# Altium schematic sheet InfoDisplay.SchDoc
size A4
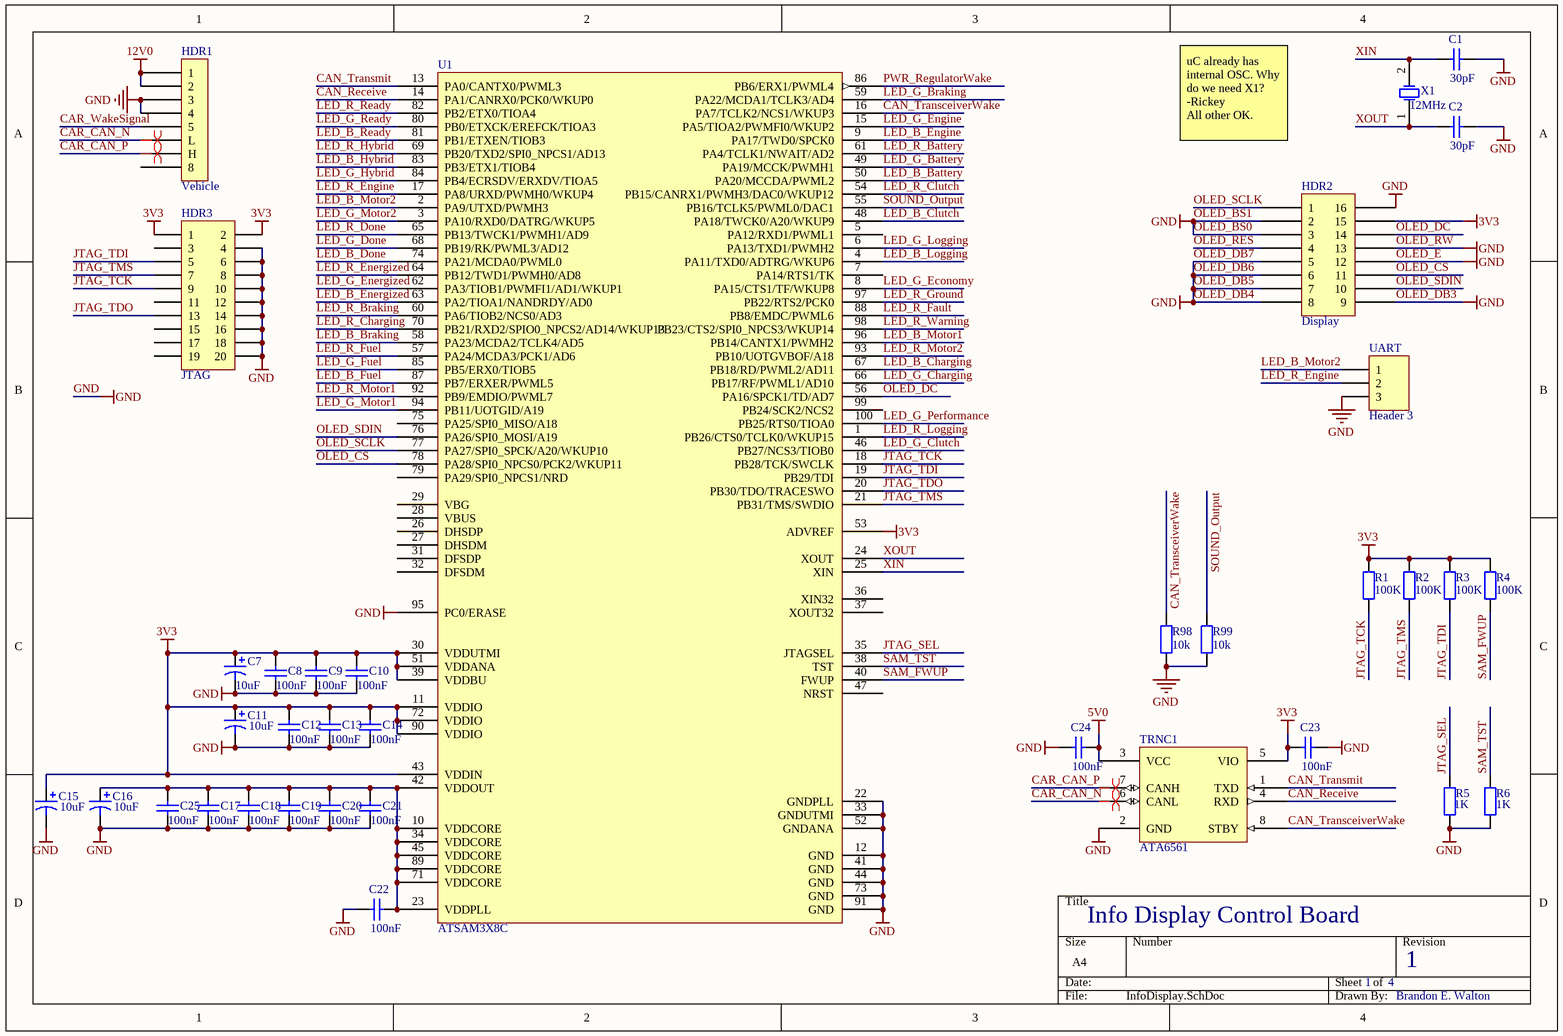
[diagram p0: InfoDisplay.SchDoc]

## Parts
C1  value 30pF  [1608[0603]]  (hidden comment: CL10C300FB8NNNC)
C2  value 30pF  [1608[0603]]  (hidden comment: Cap)
C7  value 10uF  [CAPC3216M]  (hidden comment: Cap Pol1)
C8  value 100nF  [CAPC1608M]  (hidden comment: Cap)
C9  value 100nF  [CAPC1608M]  (hidden comment: Cap)
C10  value 100nF  [CAPC1608M]  (hidden comment: Cap)
C11  value 10uF  [CAPC3216M]  (hidden comment: Cap Pol1)
C12  value 100nF  [CAPC1608M]  (hidden comment: Cap)
C13  value 100nF  [CAPC1608M]  (hidden comment: Cap)
C14  value 100nF  [CAPC1608M]  (hidden comment: Cap)
C15  value 10uF  [CAPC3216M]  (hidden comment: Cap Pol1)
C16  value 10uF  [CAPC3216M]  (hidden comment: Cap Pol1)
C17  value 100nF  [CAPC1608M]  (hidden comment: Cap)
C18  value 100nF  [CAPC1608M]  (hidden comment: Cap)
C19  value 100nF  [CAPC1608M]  (hidden comment: Cap)
C20  value 100nF  [CAPC1608M]  (hidden comment: Cap)
C21  value 100nF  [CAPC1608M]  (hidden comment: Cap)
C22  value 100nF  [CAPC1608M]  (hidden comment: Cap)
C23  value 100nF  [CAPC1608M]  (hidden comment: Cap)
C24  value 100nF  [CAPC1608M]  (hidden comment: Cap)
C25  value 100nF  [CAPC1608M]  (hidden comment: Cap)
HDR1  Vehicle  [Molex_DuraClick_8Pin_Vertical]
HDR2  Display  [Molex_iGrid_16Pin_Vertical_Alt]
HDR3  JTAG  [HDR2X10]
R1  value 100K  [1608[0603]]  (hidden comment: Res2)
R2  value 100K  [1608[0603]]  (hidden comment: Res2)
R3  value 100K  [1608[0603]]  (hidden comment: Res2)
R4  value 100K  [1608[0603]]  (hidden comment: Res2)
R5  value 1K  [1608[0603]]  (hidden comment: Res2)
R6  value 1K  [1608[0603]]  (hidden comment: Res2)
R98  value 10k  [1608[0603]]  (hidden comment: RC0603JR-0710KL)
R99  value 10k  [1608[0603]]  (hidden comment: 311-10KGRCT-ND)
TRNC1  ATA6561  [SOP127P600X165-8M]
U1  ATSAM3X8C  [100-LQFP]
UART  Header 3  [HDR1X3]
X1  12MHz  [XTAL]

## Nets
3V3: C7.1 C8.1 C9.1 C10.1 C11.1 C12.1 C13.1 C14.1 C15.1 C23.2 HDR2.15 HDR3.1 HDR3.2 R1.2 R2.2 R3.2 R4.2 TRNC1.5(VIO) U1.11(VDDIO) U1.30(VDDUTMI) U1.39(VDDBU) U1.43(VDDIN) U1.51(VDDANA) U1.53(ADVREF) U1.72(VDDIO) U1.90(VDDIO)
5V0: C24.1 TRNC1.3(VCC)
12V0: HDR1.A1(1) HDR1.A2(2)
GND: C1.1 C2.1 C7.2 C8.2 C9.2 C10.2 C11.2 C12.2 C13.2 C14.2 C15.2 C16.2 C17.2 C18.2 C19.2 C20.2 C21.2 C22.2 C23.1 C24.2 C25.2 HDR1.A3(3) HDR1.A4(4) HDR2.2 HDR2.3 HDR2.5 HDR2.6 HDR2.7 HDR2.8 HDR2.9 HDR2.12 HDR2.13 HDR2.16 HDR3.4 HDR3.6 HDR3.8 HDR3.10 HDR3.12 HDR3.14 HDR3.16 HDR3.18 HDR3.20 R5.1 R6.1 R98.1 R99.1 TRNC1.2(GND) U1.12(GND) U1.22(GNDPLL) U1.33(GNDUTMI) U1.41(GND) U1.44(GND) U1.52(GNDANA) U1.73(GND) U1.91(GND) U1.95(PC0/ERASE) UART.3  [also labelled OLED_BS0, OLED_BS1, OLED_DB3, OLED_DB4, OLED_DB5, OLED_DB6, OLED_DB7, OLED_E, OLED_RW]
CAN_Receive: TRNC1.4(RXD) U1.14(PA1/CANRX0/PCK0/WKUP0)
CAN_TransceiverWake: R98.2 TRNC1.8(STBY) U1.16(PA7/TCLK2/NCS1/WKUP3)
CAN_Transmit: TRNC1.1(TXD) U1.13(PA0/CANTX0/PWML3)
CAR_CAN_N: HDR1.A6(L) TRNC1.6(CANL)
CAR_CAN_P: HDR1.A7(H) TRNC1.7(CANH)
CAR_WakeSignal: HDR1.A5(5)
JTAG_SEL: R5.2 U1.35(JTAGSEL)
JTAG_TCK: HDR3.9 R1.1 U1.18(PB28/TCK/SWCLK)
JTAG_TDI: HDR3.5 R3.1 U1.19(PB29/TDI)
JTAG_TDO: HDR3.13 U1.20(PB30/TDO/TRACESWO)
JTAG_TMS: HDR3.7 R2.1 U1.21(PB31/TMS/SWDIO)
LED_B_Battery: U1.50(PA20/MCCDA/PWML2)
LED_B_Braking: U1.58(PA23/MCDA2/TCLK4/AD5)
LED_B_Charging: U1.67(PB18/RD/PWML2/AD11)
LED_B_Clutch: U1.48(PA18/TWCK0/A20/WKUP9)
LED_B_Done: U1.74(PA21/MCDA0/PWML0)
LED_B_Energized: U1.63(PA2/TIOA1/NANDRDY/AD0)
LED_B_Engine: U1.9(PA17/TWD0/SPCK0)
LED_B_Fuel: U1.87(PB7/ERXER/PWML5)
LED_B_Hybrid: U1.83(PB3/ETX1/TIOB4)
LED_B_Logging: U1.4(PA11/TXD0/ADTRG/WKUP6)
LED_B_Motor1: U1.96(PB14/CANTX1/PWMH2)
LED_B_Motor2: U1.2(PA9/UTXD/PWMH3) UART.1
LED_B_Ready: U1.81(PB1/ETXEN/TIOB3)
LED_G_Battery: U1.49(PA19/MCCK/PWMH1)
LED_G_Braking: U1.59(PA22/MCDA1/TCLK3/AD4)
LED_G_Charging: U1.66(PB17/RF/PWML1/AD10)
LED_G_Clutch: U1.46(PB27/NCS3/TIOB0)
LED_G_Done: U1.68(PB19/RK/PWML3/AD12)
LED_G_Economy: U1.8(PA15/CTS1/TF/WKUP8)
LED_G_Energized: U1.62(PA3/TIOB1/PWMFI1/AD1/WKUP1)
LED_G_Engine: U1.15(PA5/TIOA2/PWMFI0/WKUP2)
LED_G_Fuel: U1.85(PB5/ERX0/TIOB5)
LED_G_Hybrid: U1.84(PB4/ECRSDV/ERXDV/TIOA5)
LED_G_Logging: U1.6(PA13/TXD1/PWMH2)
LED_G_Motor1: U1.94(PB11/UOTGID/A19)
LED_G_Motor2: U1.3(PA10/RXD0/DATRG/WKUP5)
LED_G_Performance: U1.100(PB25/RTS0/TIOA0)
LED_G_Ready: U1.80(PB0/ETXCK/EREFCK/TIOA3)
LED_R_Battery: U1.61(PA4/TCLK1/NWAIT/AD2)
LED_R_Braking: U1.60(PA6/TIOB2/NCS0/AD3)
LED_R_Charging: U1.70(PB21/RXD2/SPIO0_NPCS2/AD14/WKUP13)
LED_R_Clutch: U1.54(PB15/CANRX1/PWMH3/DAC0/WKUP12)
LED_R_Done: U1.65(PB13/TWCK1/PWMH1/AD9)
LED_R_Energized: U1.64(PB12/TWD1/PWMH0/AD8)
LED_R_Engine: U1.17(PA8/URXD/PWMH0/WKUP4) UART.2
LED_R_Fault: U1.88(PB8/EMDC/PWML6)
LED_R_Fuel: U1.57(PA24/MCDA3/PCK1/AD6)
LED_R_Ground: U1.97(PB22/RTS2/PCK0)
LED_R_Hybrid: U1.69(PB20/TXD2/SPI0_NPCS1/AD13)
LED_R_Logging: U1.1(PB26/CTS0/TCLK0/WKUP15)
LED_R_Motor1: U1.92(PB9/EMDIO/PWML7)
LED_R_Motor2: U1.93(PB10/UOTGVBOF/A18)
LED_R_Ready: U1.82(PB2/ETX0/TIOA4)
LED_R_Warning: U1.98(PB23/CTS2/SPI0_NPCS3/WKUP14)
OLED_CS: HDR2.11 U1.78(PA28/SPI0_NPCS0/PCK2/WKUP11)
OLED_DC: HDR2.14 U1.56(PA16/SPCK1/TD/AD7)
OLED_RES: HDR2.4
OLED_SCLK: HDR2.1 U1.77(PA27/SPI0_SPCK/A20/WKUP10)
OLED_SDIN: HDR2.10 U1.76(PA26/SPI0_MOSI/A19)
PWR_RegulatorWake: U1.86(PB6/ERX1/PWML4)
SAM_FWUP: R4.1 U1.40(FWUP)
SAM_TST: R6.2 U1.38(TST)
SOUND_Output: R99.2 U1.55(PB16/TCLK5/PWML0/DAC1)
XIN: C1.2 U1.25(XIN) X1.2(OSC2)
XOUT: C2.2 U1.24(XOUT) X1.1(OSC1)
NetC16_1: C16.1 C17.1 C18.1 C19.1 C20.1 C21.1 C22.1 C25.1 U1.10(VDDCORE) U1.23(VDDPLL) U1.34(VDDCORE) U1.42(VDDOUT) U1.45(VDDCORE) U1.71(VDDCORE) U1.89(VDDCORE)

Not connected (* = marked no-connect by the designer): HDR1 A8(8); HDR3 3 11 15 17 19; U1 5(PA12/RXD1/PWML1) 7(PA14/RTS1/TK) 26(DHSDP) 27(DHSDM) 28(VBUS) 29(VBG) 31(DFSDP) 32(DFSDM) 36(XIN32) 37(XOUT32) 47(NRST) 75(PA25/SPI0_MISO/A18) 79(PA29/SPI0_NPCS1/NRD) 99(PB24/SCK2/NCS2)

## Layout directives
differential pair: CAR_CAN_N, CAR_CAN_P

## Notes on the sheet
- uC already has internal OSC. Why do we need X1? -Rickey
  All other OK.
- Info Display Control Board
- 1
- 4
- Brandon E. Walton

## Library data of the parts
C1 = Cap: Capacitor; Published: 8-Jun-2000; LatestRevisionDate: 17-Jul-2002; LatestRevisionNote: Re-released for DXP Platform.; PackageReference: RAD-0.3; Publisher: Altium Limited; PackageDescription: Radial Cap, Thru-Hole; 2 Leads; 0.3 in Pin Spacing; Digikey: 1276-2259-1-ND; PartNumber: CL10C300FB8NNNC
C2 = Cap: Capacitor; PartNumber: CL10C300FB8NNNC; Published: 8-Jun-2000; LatestRevisionDate: 17-Jul-2002; LatestRevisionNote: Re-released for DXP Platform.; PackageReference: RAD-0.3; Publisher: Altium Limited; PackageDescription: Radial Cap, Thru-Hole; 2 Leads; 0.3 in Pin Spacing; Digikey: 1276-2259-1-ND; Manufacturer PartNo: CL10C300FB8NNNC
C7 C11 C16 = Cap Pol1: Polarized Capactior; Published: 8-Jun-2000; LatestRevisionDate: 17-Jul-2002; LatestRevisionNote: Re-released for DXP Platform.; PackageReference: RB7.6-15; Publisher: Altium Limited; PackageDescription: Polarized Capacitor (Radial); 2 Leads; Digikey: 495-2200-1-ND
C8-C10 C12-C14 C18-C25 = Cap: Capacitor; Partnumber: GRM188R71E104KA01D; Published: 8-Jun-2000; LatestRevisionDate: 17-Jul-2002; LatestRevisionNote: Re-released for DXP Platform.; PackageReference: RAD-0.3; Publisher: Altium Limited; PackageDescription: Radial Cap, Thru-Hole; 2 Leads; 0.3 in Pin Spacing; Digikey: 490-1524-1-ND
C15 = Cap Pol1: Polarized Capactior; PartNumber: T491A106K010ZT; Published: 8-Jun-2000; LatestRevisionDate: 17-Jul-2002; LatestRevisionNote: Re-released for DXP Platform.; PackageReference: RB7.6-15; Publisher: Altium Limited; PackageDescription: Polarized Capacitor (Radial); 2 Leads; Digikey: 495-2200-1-ND
C17 = Cap: Capacitor; PartNumber: GRM188R71E104KA01D; Published: 8-Jun-2000; LatestRevisionDate: 17-Jul-2002; LatestRevisionNote: Re-released for DXP Platform.; PackageReference: RAD-0.3; Publisher: Altium Limited; PackageDescription: Radial Cap, Thru-Hole; 2 Leads; 0.3 in Pin Spacing; Digikey: 490-1524-1-ND; Partnumber: GRM188R71E104KA01D
HDR1 = Molex_DuraClick_8Pin_Vertical: Molex iClick Series Connector, 8 Pin
HDR2 = Molex_iGrid_16Pin_Vertical: Molex iGrid Series Connector, 2 Row, 16 Pin
HDR3 = Header 10X2: JTAG Header, 10-Pin, Dual row, 2.56 pitch, Male; LatestRevisionDate: 17-Jul-2002; LatestRevisionNote: Re-released for DXP Platform.; Publisher: Altium Limited
R1-R4 = Res2: Resistor; PartNumber: MCT06030C1003FP500; Published: 8-Jun-2000; LatestRevisionDate: 17-Jul-2002; LatestRevisionNote: Re-released for DXP Platform.; PackageReference: AXIAL-0.4; Publisher: Altium Limited; PackageDescription: Axial Device, Thru-Hole; 2 Leads; 0.4 in Pin Spacing; Digikey: MCT0603-100K-CFCT-ND
R5 R6 = Res2: Resistor; PartNumber: MCT06030C1001FP500; Published: 8-Jun-2000; LatestRevisionDate: 17-Jul-2002; LatestRevisionNote: Re-released for DXP Platform.; PackageReference: AXIAL-0.4; Publisher: Altium Limited; PackageDescription: Axial Device, Thru-Hole; 2 Leads; 0.4 in Pin Spacing; Digikey: MCT0603-1.00K-CFCT-ND
R98 R99 = Res2: Resistor; Published: 8-Jun-2000; LatestRevisionDate: 17-Jul-2002; LatestRevisionNote: Re-released for DXP Platform.; PackageReference: AXIAL-0.4; Publisher: Altium Limited; PackageDescription: Axial Device, Thru-Hole; 2 Leads; 0.4 in Pin Spacing; Digikey: 311-10KGRCT-ND
TRNC1 = ATA6561: Atmel CAN Transceiver; Digikey: ATA6561; PartNumber: ATA6561
U1 = ATSAM3X8CA-AU: Atmel SAM Series Microcontroller; DigiKey: ATSAM3X8CA-AU-ND; PartNumber: ATSAM3X8CA-AU
UART = Header 3: Header, 3-Pin; LatestRevisionDate: 17-Jul-2002; LatestRevisionNote: Re-released for DXP Platform.; Publisher: Altium Limited
X1 = XTAL: 12MHz Crystal Oscillator; PartNumber: ECS-120-20-3X-EN-TR; Published: 8-Jun-2000; LatestRevisionDate: 17-Jul-2002; LatestRevisionNote: Re-released for DXP Platform.; PackageReference: R38; Publisher: Altium Limited; PackageDescription: Crystal, Thru-Hole; 2 Leads; Body 3.1 x 8.2 mm (Dia.xH); Digikey: XC1787CT-ND